# EAGLE design 526_outin_pico_pdm (EAGLE 9.6.2)
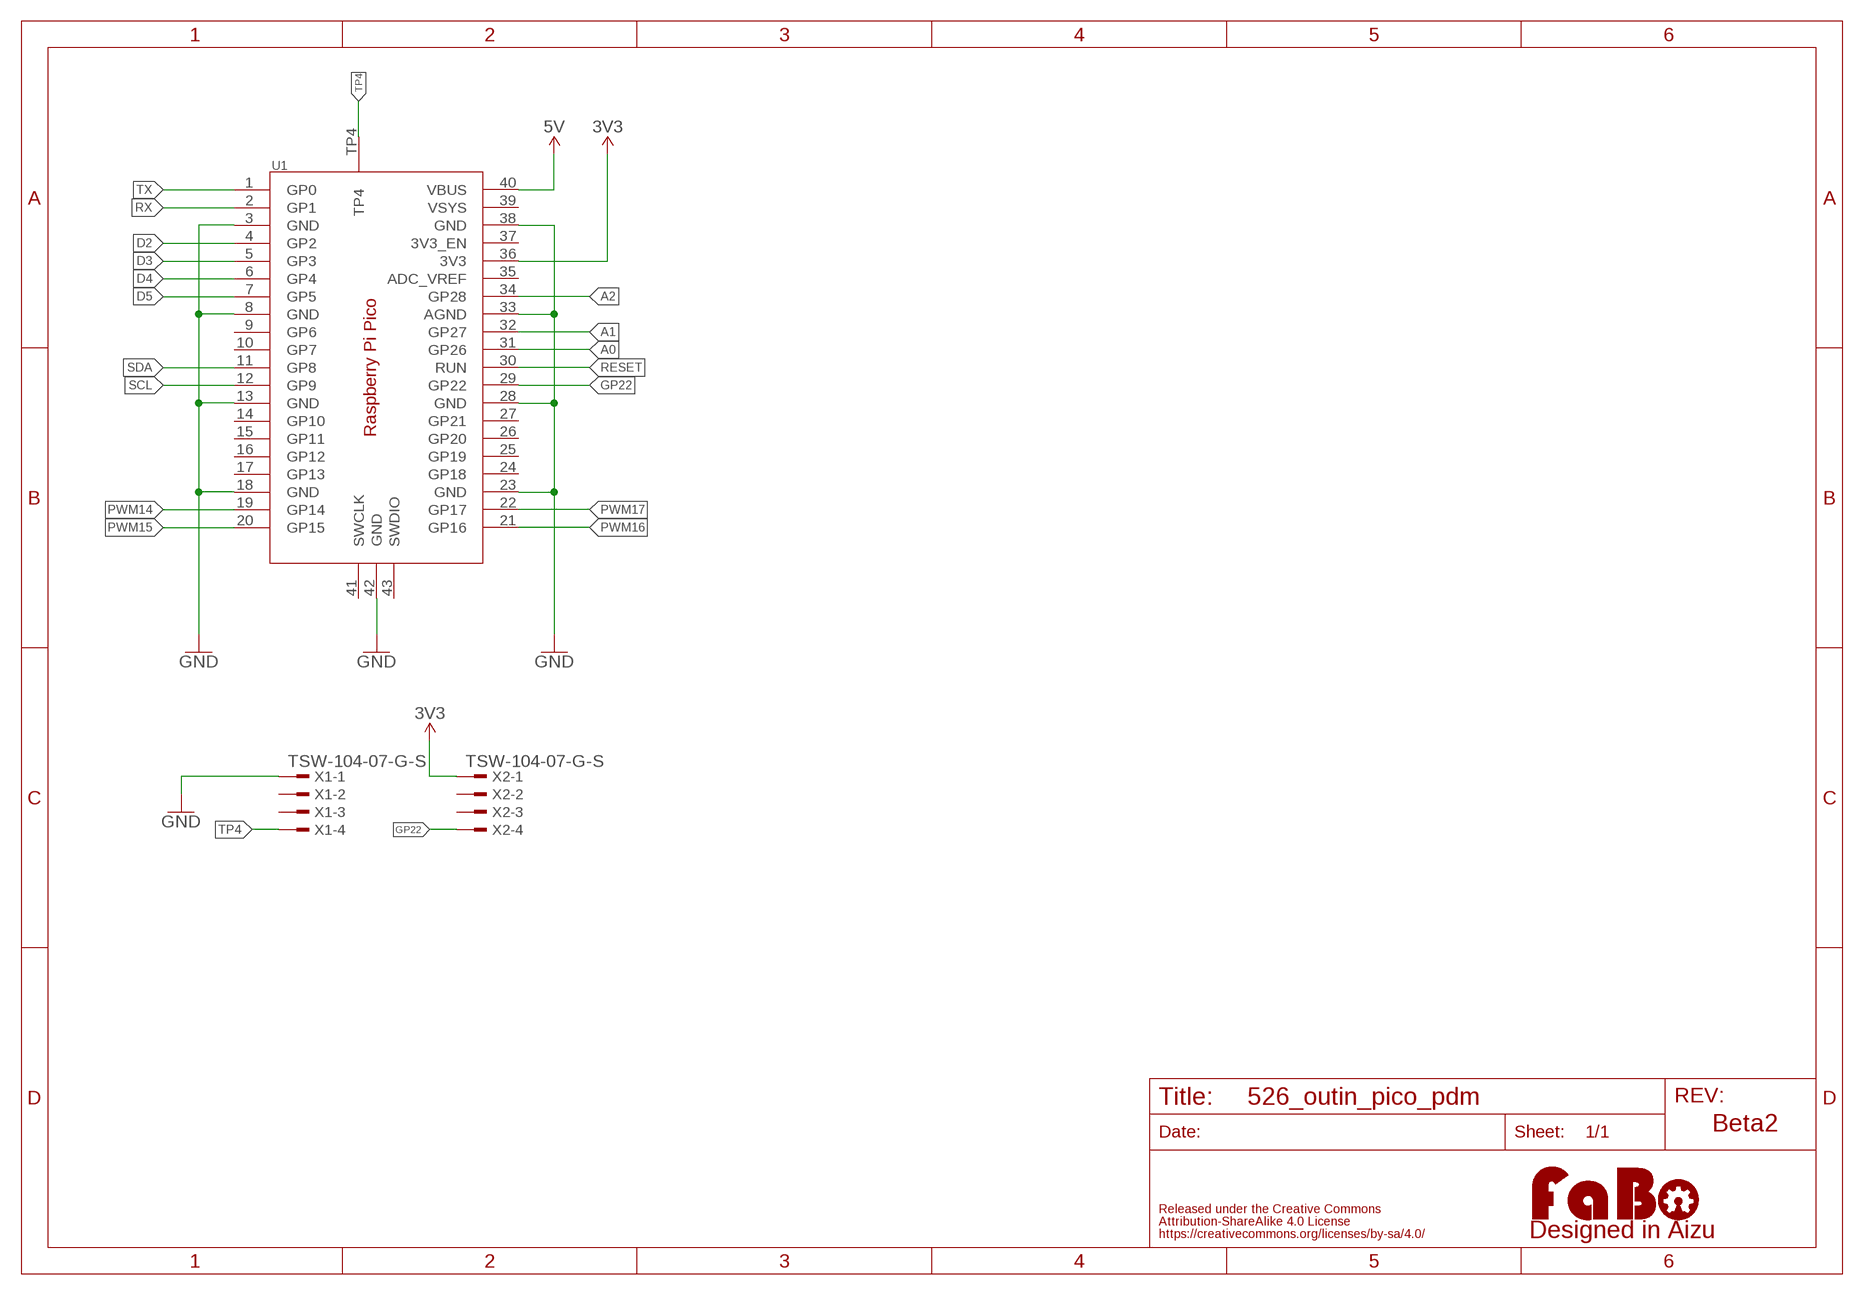
[diagram p0: schematic, sheet 1]

## Parts
LOGO2  LOGO_FABO-M  [LOGO_FABO_M]
U1  RASPBERRY_PI_PICOPDM  [RASPBERRY_PI_PICO_HEADER]
X1  TSW-104-07-G-S  [TSW-104-XX-G-S]
X2  TSW-104-07-G-S  [TSW-104-XX-G-S]

## Nets
3V3: U1.36(3V3) X2.1
5V: U1.40(VBUS)
A0: U1.31(GP26)
A1: U1.32(GP27)
A2: U1.34(GP28)
D2: U1.4(GP2)
D3: U1.5(GP3)
D4: U1.6(GP4)
D5: U1.7(GP5)
GND: U1.3(GND) U1.8(GND) U1.13(GND) U1.18(GND) U1.23(GND) U1.28(GND) U1.33(AGND) U1.38(GND) U1.42(GND) X1.1
GP22: U1.29(GP22) X2.4
PWM14: U1.19(GP14)
PWM15: U1.20(GP15)
PWM16: U1.21(GP16)
PWM17: U1.22(GP17)
RESET: U1.30(RUN)
RX: U1.2(GP1)
SCL: U1.12(GP9)
SDA: U1.11(GP8)
TP4: U1.TP4 X1.4
TX: U1.1(GP0)
Unconnected: U1.9(GP6) U1.10(GP7) U1.14(GP10) U1.15(GP11) U1.16(GP12) U1.17(GP13) U1.24(GP18) U1.25(GP19) U1.26(GP20) U1.27(GP21) U1.35(ADC_VREF) U1.37(3V3_EN) U1.39(VSYS) U1.41(SWCLK) U1.43(SWDIO) X1.2 X1.3 X2.2 X2.3

## Notes on the sheet
- Beta2

## Library data of the parts
LOGO2 = FaBo-Logo:LOGO_FABO
U1 = FaBo-Boards:RASPBERRY_PI_PICO
X1 X2 = con-samtec:TSW-104-*-G-S: THROUGH-HOLE .025" SQ POST HEADER Source: Samtec TSW.pdf; MF: Samtec Inc.; MPN: TSW-104-07-G-S

## Board
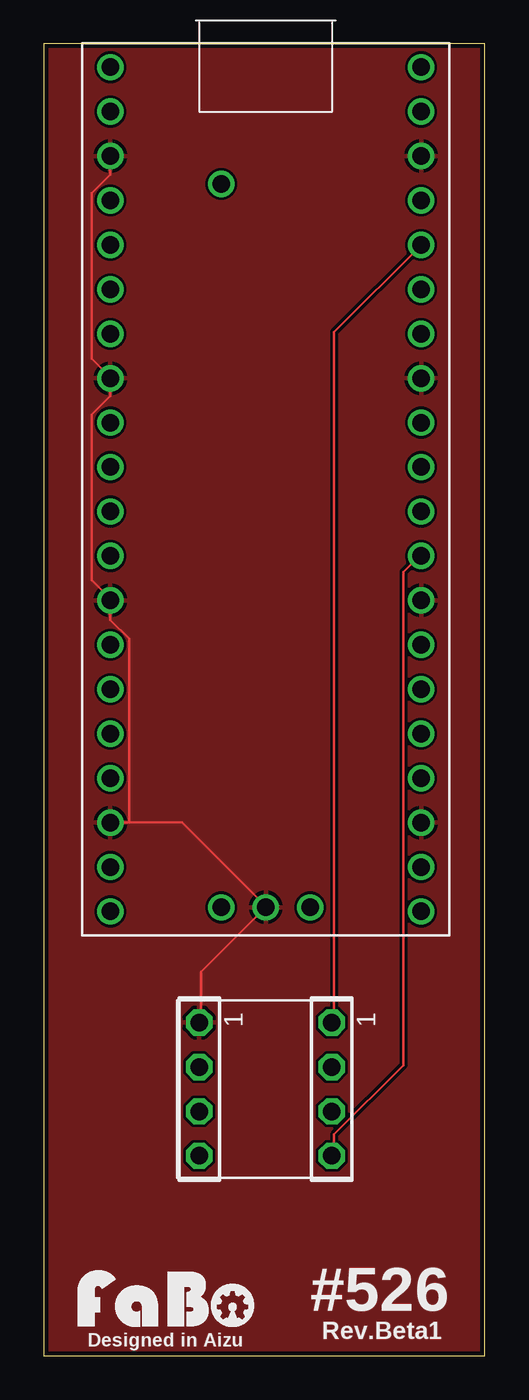
[diagram p1: board, top side]
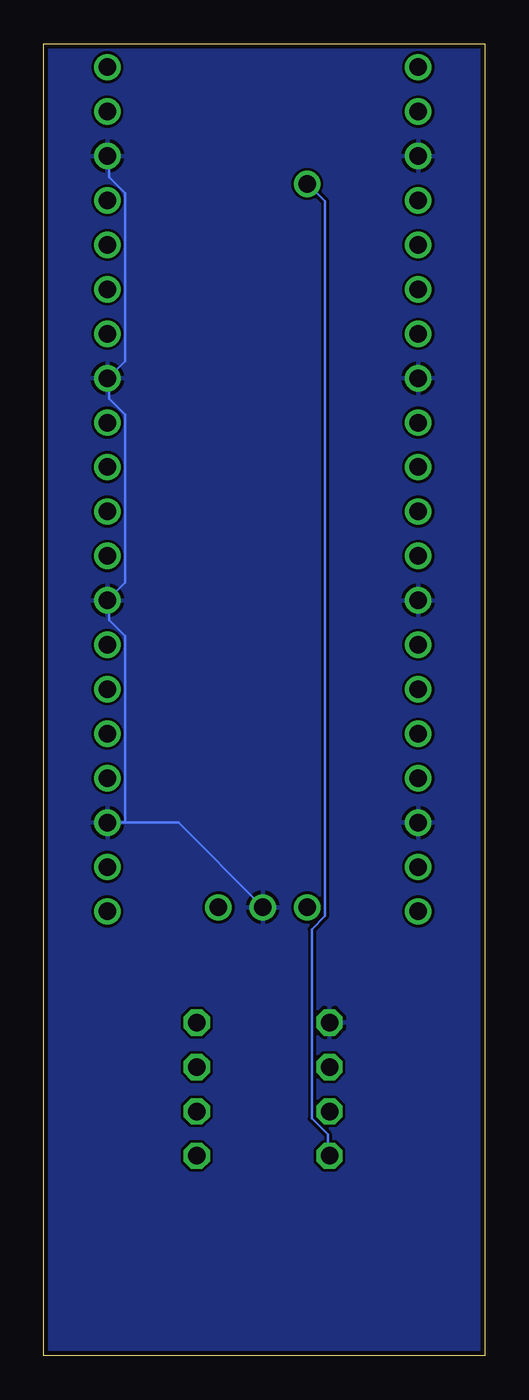
[diagram p2: board, bottom side, seen from below]

Size 25.23 x 75 mm. Coordinates in mm from the lower left corner, seen from the top.
Outline: 0,0 25.23,0 25.23,75 0,75 0,0
Copper layers (1*16): Top 0.035mm / dielectric 1.6mm / Bottom 0.035mm
Design rules "PCBway": minimum track width 6mil, minimum drill 12mil, track to track 6mil, track to pad 6mil, pad to pad 6mil, via to via 6mil, smd to smd 6mil, copper to edge 10mil, drill to drill 10mil, minimum pad ring 10mil, minimum via ring 6mil, stop-mask expansion 2mil, vias tented up to drill 100mil, thermal gap 8mil

### Footprints (pad centres in the part's own frame; a part is rotated, then mirrored left to right if it is on the bottom)
RASPBERRY_PI_PICO_HEADER = drill 1: 1 -8.89,24.13; 2 -8.89,21.59; 3 -8.89,19.05; 4 -8.89,16.51; 5 -8.89,13.97; 6 -8.89,11.43; 7 -8.89,8.89; 8 -8.89,6.35; 9 -8.89,3.81; 10 -8.89,1.27; 11 -8.89,-1.27; 12 -8.89,-3.81; 13 -8.89,-6.35; 14 -8.89,-8.89; 15 -8.89,-11.43; 16 -8.89,-13.97; 17 -8.89,-16.51; 18 -8.89,-19.05; 19 -8.89,-21.59; 20 -8.89,-24.13; 21 8.89,-24.13; 22 8.89,-21.59; 23 8.89,-19.05; 24 8.89,-16.51; 25 8.89,-13.97; 26 8.89,-11.43; 27 8.89,-8.89; 28 8.89,-6.35; 29 8.89,-3.81; 30 8.89,-1.27; 31 8.89,1.27; 32 8.89,3.81; 33 8.89,6.35; 34 8.89,8.89; 35 8.89,11.43; 36 8.89,13.97; 37 8.89,16.51; 38 8.89,19.05; 39 8.89,21.59; 40 8.89,24.13; 41 -2.54,-23.9; 42 0,-23.9; 43 2.54,-23.9; TP4 -2.54,17.462
TSW-104-XX-G-S = drill 1 pad 1.5 octagon: 1 3.81,0; 2 1.27,0; 3 -1.27,0; 4 -3.81,0

### Placement (x,y rotation side)
LOGO2  6.99,1.27 0 top
U1  12.7,49.53 0 top
X1  8.89,15.24 90 top
X2  16.48,15.24 90 top

### Tracks (layer width: path | path; a pad name or v marks a point on that pad's centre or on a via)
3V3
  Top 0.152: U1.36 16.61,58.52 16.61,19.05 X2.1
GND
  Top 0.152: 4.88,30.48 7.92,30.48 12.65,25.76 U1.42 12.65,25.6 8.99,21.95 8.99,19.05 X1.1 | 4.88,30.48 U1.18 | 4.88,30.48 4.88,41 3.81,42.06 U1.13 3.81,43.28 2.74,44.35 2.74,53.8 3.81,54.86 U1.8 3.81,55.93 2.74,57 2.74,66.45 3.81,67.51 U1.3
  Bottom 0.152: 20.57,30.48 17.53,30.48 12.8,25.76 U1.42 | 20.57,30.48 U1.23 | 20.57,30.48 20.57,41.15 21.49,42.06 21.49,43.13 U1.28 20.57,44.2 20.57,53.8 21.49,54.71 21.49,55.78 U1.33 21.49,55.93 20.57,56.84 20.57,66.45 21.49,67.36 21.49,68.58 U1.38
  pour Top: 0.1,76.2 25.4,76.2 25.4,0 0,0
  pour Bottom: 0,0 25.4,0 25.4,76.2 0,76.2
GP22
  Top 0.152: X2.4 16.61,11.43 16.61,12.65 20.57,16.61 20.57,44.81 21.49,45.72 U1.29
TP4
  Bottom 0.152: X1.4 8.99,11.43 8.99,12.65 9.91,13.56 9.91,24.38 9.14,25.15 9.14,65.99 10.06,66.9 U1.TP4

### Text on the board
tPlace: #526 | Designed in Aizu | Rev.Beta1